# EAGLE design sparrow-though-jack-var (EAGLE 6.1)
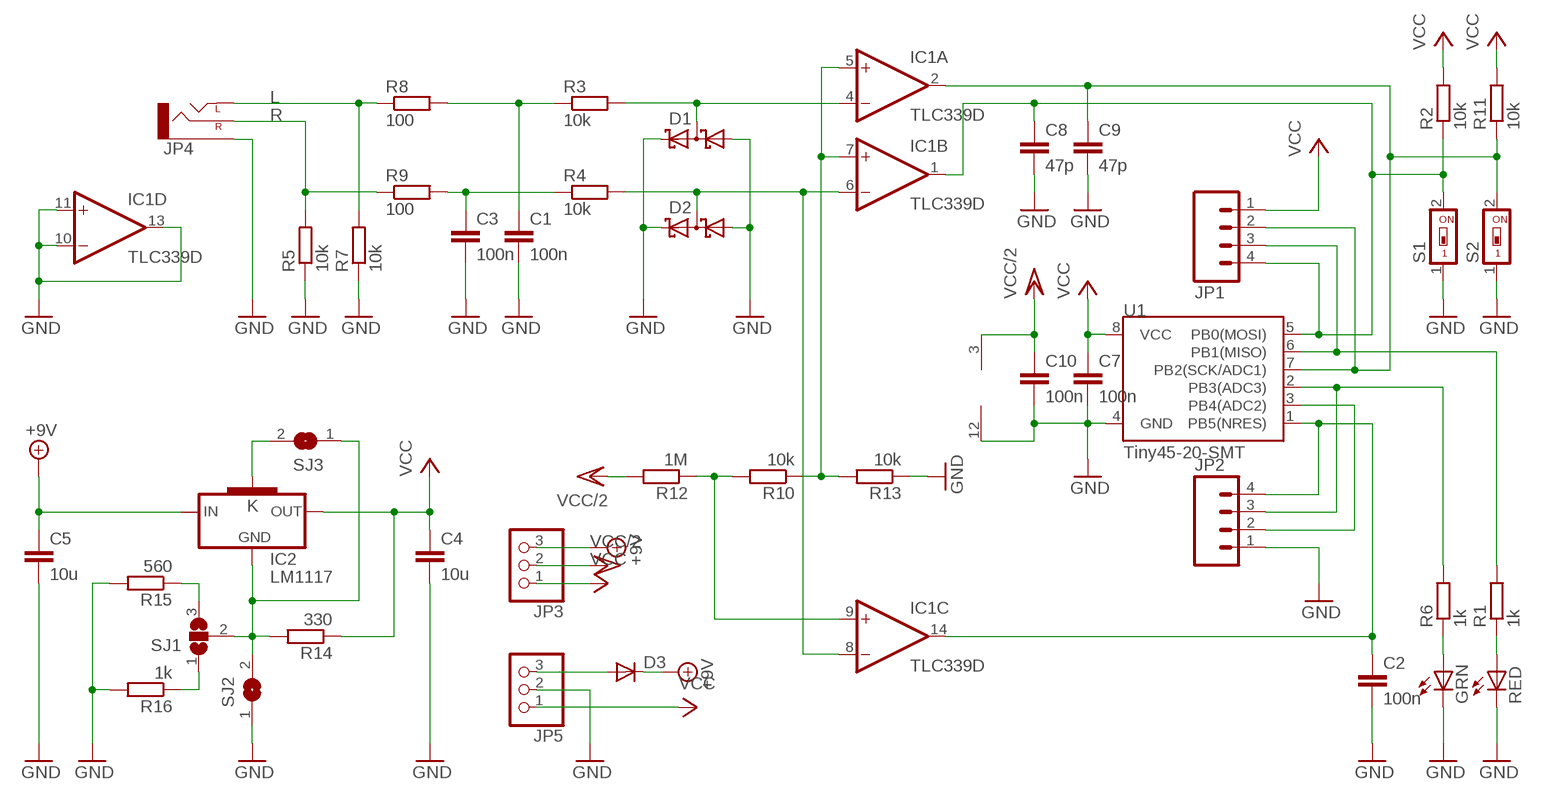
[diagram p0: schematic, sheet 1]

## Parts
C1  100n  C-EUC0805K  [C0805K]
C2  100n  C-EUC0805K  [C0805K]
C3  100n  C-EUC0805K  [C0805K]
C4  10u  C-EUC0805K  [C0805K]
C5  10u  C-EUC0805K  [C0805K]
C7  100n  C-EUC0805K  [C0805K]
C8  47p  C-EUC0805K  [C0805K]
C9  47p  C-EUC0805K  [C0805K]
C10  100n  C-EUC0805K  [C0805K]
D1  BAT54S  [SOT23]
D2  BAT54S  [SOT23]
D3  DIODE-MINIMELF  [MINIMELF]
GRN  LEDCHIP-LED0805  [CHIP-LED0805]
IC1  TLC339D  [SO14]
IC2  LM1117  LD1117S50  [SOT223]
JP1  M04PTH  [1X04]
JP2  M04PTH  [1X04]
JP3  PINHD-1X3  [1X03]
JP4  AUDIO-JACKPIN-HOLES  [AUDIO-JACK-HOLES]
JP5  PINHD-1X3  [1X03]
R1  1k  R-EU_M0805  [M0805]
R2  10k  R-EU_M0805  [M0805]
R3  10k  R-EU_M0805  [M0805]
R4  10k  R-EU_M0805  [M0805]
R5  10k  R-EU_M0805  [M0805]
R6  1k  R-EU_M0805  [M0805]
R7  10k  R-EU_M0805  [M0805]
R8  100  R-EU_M0805  [M0805]
R9  100  R-EU_M0805  [M0805]
R10  10k  R-EU_M0805  [M0805]
R11  10k  R-EU_M0805  [M0805]
R12  1M  R-EU_M0805  [M0805]
R13  10k  R-EU_M0805  [M0805]
R14  330  R-EU_M0805  [M0805]
R15  560  R-EU_M0805  [M0805]
R16  1k  R-EU_M0805  [M0805]
RED  LEDCHIP-LED0805  [CHIP-LED0805]
S1  SWS001  [SMS-001]
S2  SWS001  [SMS-001]
SJ1  SJ2W  [SJ_2]
SJ2  SJ  [SJ]
SJ3  SJ  [SJ]
U1  Tiny45-20-SMT  ATTINY45TINY45-20-SMT  [SO08-EIAJ]

## Nets
+9V: C5.1 D3.C IC2.3(IN) JP3.3
GND: C1.2 C2.2 C3.2 C4.2 C5.2 C7.2 C8.2 C9.2 C10.2 D1.1(A1) D1.2(C2) D2.1(A1) D2.2(C2) GRN.C IC1.10(D:-IN) IC1.11(D:+IN) IC1.12(P:V-) IC1.13(D:OUT) JP2.1 JP4.GND(SLEEVE) JP5.2 R5.1 R7.1 R13.1 R15.2 R16.2 RED.C S1.1 S2.1 SJ2.1 U1.4(GND)
L: JP4.L1-(LEFT) JP4.L2-(LEFT) R7.2 R8.1
N$1: D1.3(C1A2) IC1.4(A:-IN) R3.2
N$2: JP2.3 R6.2 U1.2(PB3(ADC3))
N$3: C2.1 IC1.14(C:OUT) JP2.4 U1.1(PB5(NRES))
N$4: JP2.2 U1.3(PB4(ADC2))
N$5: IC2.4(K) SJ3.2
N$6: D2.3(C1A2) IC1.6(B:-IN) IC1.8(C:-IN) R4.2
N$7: JP1.3 R1.2 U1.6(PB1(MISO))
N$8: C9.1 IC1.2(A:OUT) JP1.2 R11.1 S2.2 U1.7(PB2(SCK/ADC1))
N$9: C1.1 R3.1 R8.2
N$10: GRN.A R6.1
N$11: R1.1 RED.A
N$12: C3.1 R4.1 R9.2
N$13: C8.1 IC1.1(B:OUT) JP1.4 R2.1 S1.2 U1.5(PB0(MOSI))
N$14: IC2.1(GND) R14.2 SJ1.2 SJ2.2 SJ3.1
N$15: R15.1 SJ1.3
N$16: IC1.9(C:+IN) R10.2 R12.1
N$17: IC1.5(A:+IN) IC1.7(B:+IN) R10.1 R13.2
N$18: R16.1 SJ1.1
N$19: D3.A JP5.3
R: JP4.R+(RIGHT) R5.2 R9.1
VCC: C4.1 C7.1 IC2.2(OUT) JP1.1 JP3.1 JP5.1 R2.2 R11.2 R14.1 U1.8(VCC)
VCC/2: C10.1 IC1.3(P:V+) JP3.2 R12.2

## Library data of the parts
C1-C5 C7-C10 = rcl:C-EU: CAPACITOR, European symbol
D1 D2 = diode:BAT54S: Schottky Diodes Pin connection corrected 2011-05-04 Source: Fairchild .. BAT54.pdf
D3 = diode:DIODE-: DIODE
GRN RED = led:LED: LED OSRAM: - CHIPLED LG R971, LG N971, LY N971, LG Q971, LY Q971, LO R971, LY R971 LH N974, LH R974 LS Q976, LO Q976, LY Q976 LO Q996 - Hyper CHIPLED LW Q18S LB Q993, LB Q99A, LB R99A - SideLED LS A670, LO A670, LY A670, LG A670, LP A670 LB A673, LV A673, LT A673, LW A673 LH A674 LY A675 LS A676, LA A676, LO A676, LY A676, LW A676 LS A679, LY A679, LG A679 - Hyper Micro SIDELED® LS Y876, LA Y876, LO Y876, LY Y876 LT Y87S - SmartLED LW L88C, LW L88S LB L89C, LB L89S, LG L890 LS L89K, LO L89K, LY L89K LS L896, LA L896, LO L896, LY L896 - TOPLED LS T670, LO T670, LY T670, LG T670, LP T670 LSG T670, LSP T670, LSY T670, LOP T670, LYG T670 LG T671, LOG T671, LSG T671 LB T673, LV T673, LT T673, LW T673 LH T674 LS T676, LA T676, LO T676, LY T676, LB T676, LH T676, LSB T676, LW T676 LB T67C, LV T67C, LT T67C, LS T67K, LO T67K, LY T67K, LW E67C LS E67B, LA E67B, LO E67B, LY E67B, LB E67C, LV E67C, LT E67C LW T67C LS T679, LY T679, LG T679 LS T770, LO T770, LY T770, LG T770, LP T770 LB T773, LV T773, LT T773, LW T773 LH T774 LS E675, LA E675, LY E675, LS T675 LS T776, LA T776, LO T776, LY T776, LB T776 LHGB T686 LT T68C, LB T68C - Hyper Mini TOPLED® LB M676 - Mini TOPLED Santana® LG M470 LS M47K, LO M47K, LY M47K Source: http://www.osram.convergy.de LUXEON: - LUMILED® LXK2-PW12-R00, LXK2-PW12-S00, LXK2-PW14-U00, LXK2-PW14-V00 LXK2-PM12-R00, LXK2-PM12-S00, LXK2-PM14-U00 LXK2-PE12-Q00, LXK2-PE12-R00, LXK2-PE12-S00, LXK2-PE14-T00, LXK2-PE14-U00 LXK2-PB12-K00, LXK2-PB12-L00, LXK2-PB12-M00, LXK2-PB14-N00, LXK2-PB14-P00, LXK2-PB14-Q00 LXK2-PR12-L00, LXK2-PR12-M00, LXK2-PR14-Q00, LXK2-PR14-R00 LXK2-PD12-Q00, LXK2-PD12-R00, LXK2-PD12-S00 LXK2-PH12-R00, LXK2-PH12-S00 LXK2-PL12-P00, LXK2-PL12-Q00, LXK2-PL12-R00 Source: www.luxeon.com KINGBRIGHT: KA-3528ASYC Source: www.kingbright.com
IC1 = linear:TLC339: COMPARATOR
IC2 = mbed-ics:LD1117S50: VOLTAGE REGULATOR SMD 5V
JP1 JP2 = SparkFun-Connectors:M04: Header 4 Standard 4-pin 0.1" header. Use with straight break away headers (SKU : PRT-00116), right angle break away headers (PRT-00553), swiss pins (PRT-00743), machine pins (PRT-00117), and female headers (PRT-00115). Molex polarized connector foot print use with SKU : PRT-08231 with associated crimp pins and housings. 1MM SMD Version SKU: PRT-10208
JP3 JP5 = pinhead:PINHD-1X3: PIN HEADER
JP4 = _MY_OWN_LIB:AUDIO-JACK: 3.5mm Audio Jack Simple 3.5mm common PCB mount audio jack. SKU: PRT-08032
R1-R16 = rcl:R-EU_: RESISTOR, European symbol
S1 S2 = smd-special:SWS001: SMD Dip Switch 1 pol.
SJ1 = jumper:SJ2W: SMD solder JUMPER
SJ2 SJ3 = jumper:SJ: SMD solder JUMPER
U1 = SparkFun-DigitalIC:ATTINY45: Atmel 8-pin 2/4/8kB flash uC; PROD_ID: IC-08922

## Board
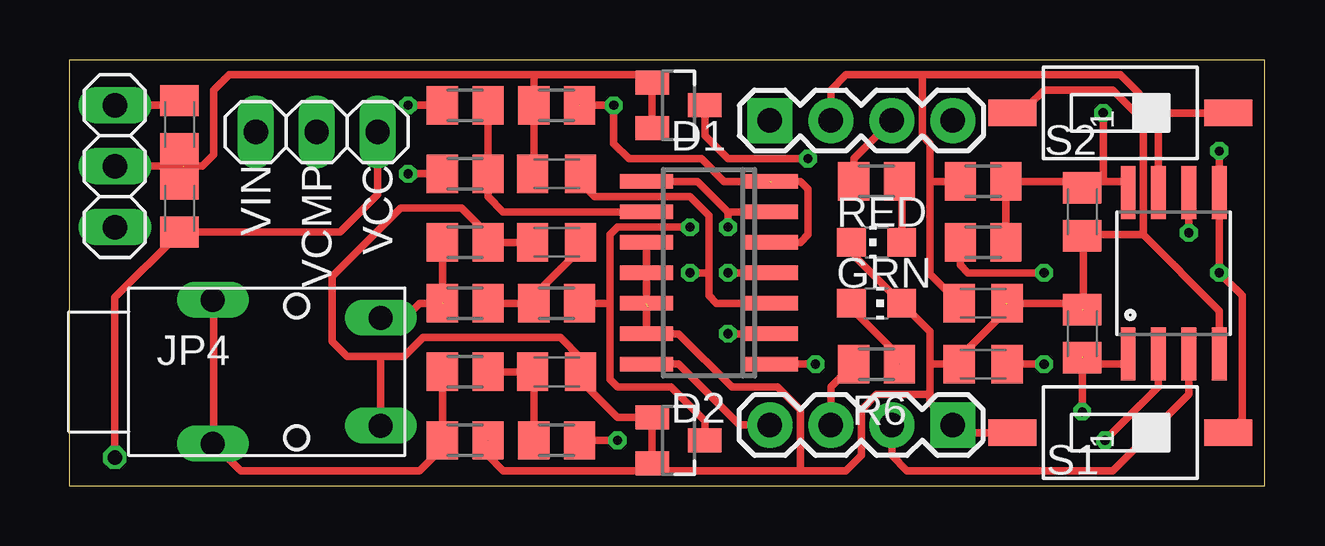
[diagram p1: board, top side]
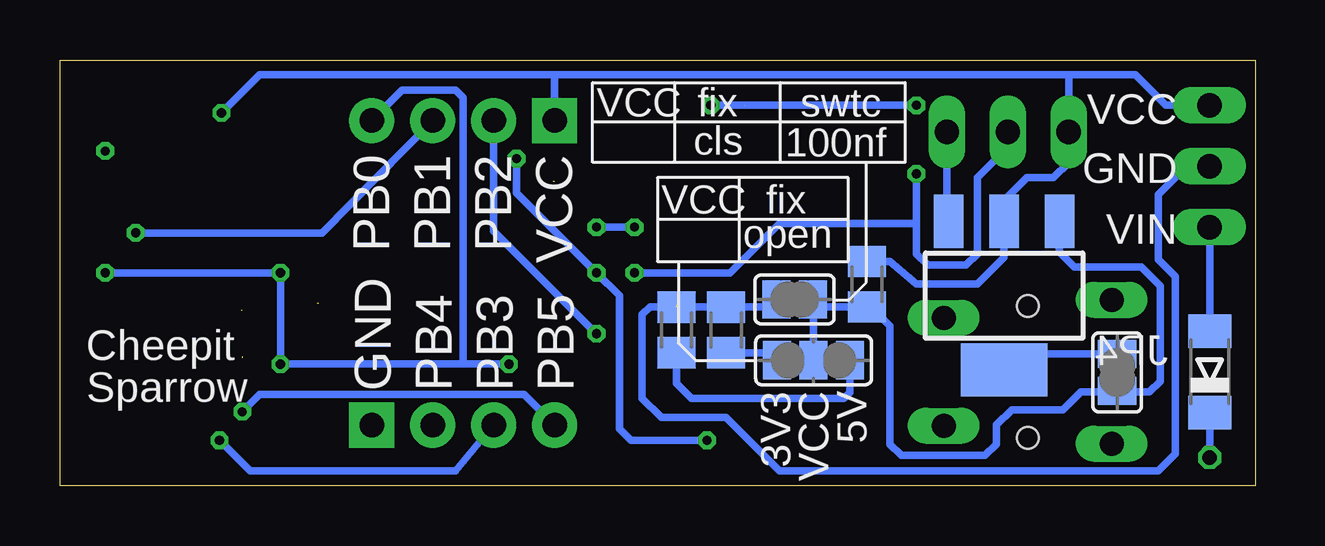
[diagram p2: board, bottom side, seen from below]

Size 49.83 x 17.77 mm. Coordinates in mm from the lower left corner, seen from the top.
Outline: 0,0 49.83,0 49.83,17.77 0,17.77 0,0
Copper layers (1*16): Top 0.0356mm / dielectric 1.5011mm / Bottom 0.0356mm
Design rules: minimum track width 6mil, minimum drill 13mil, track to track 6mil, track to pad 6mil, pad to pad 6mil, via to via 6mil, smd to smd 6mil, copper to edge 15mil, drill to drill 6mil, minimum pad ring 7mil, minimum via ring 7mil, stop-mask expansion 3mil, vias tented up to drill 0mil, thermal gap 10mil

### Footprints (pad centres in the part's own frame; a part is rotated, then mirrored left to right if it is on the bottom)
C0805K = smd 1.3 x 1.6: 1 -1,0; 2 1,0
SOT23 = smd 1 x 1.4: 1 -0.95,-1.1; 2 0.95,-1.1; 3 0,1.1
MINIMELF = smd 1.4 x 1.8: A 1.7,0; C -1.7,0
CHIP-LED0805 = smd 1.2 x 1.2: A 0,-1.05; C 0,1.05
SO14 = smd 0.6 x 2.2: 1 -3.81,-2.6; 2 -2.54,-2.6; 3 -1.27,-2.6; 4 0,-2.6; 5 1.27,-2.6; 6 2.54,-2.6; 7 3.81,-2.6; 8 3.81,2.6; 9 2.54,2.6; 10 1.27,2.6; 11 0,2.6; 12 -1.27,2.6; 13 -2.54,2.6; 14 -3.81,2.6
SOT223 = smd 1.219 x 2.235: 1 -2.311,-3.099; 2 0,-3.099; 3 2.311,-3.099 | smd 3.6 x 2.2: 4 0,3.099
1X04 = drill 1.016 pad 1.88 square: 1 0,0 | drill 1.016 pad 1.88: 2 2.54,0; 3 5.08,0; 4 7.62,0
1X03 = drill 1.016 long: 1 -2.54,0; 2 0,0; 3 2.54,0
AUDIO-JACK-HOLES = drill 1 pad 1.32 long: GND 6,-2.25; L1- -1,-3; L2- -1,3; R+ 6,2.25 | hole 0.9: 2.5,2.75; 2.5,-2.75
M0805 = smd 1.3 x 1.6: 1 -0.95,0; 2 0.95,0
SMS-001 = smd 1.092 x 2.007: 1 0,-4.496; 2 0,4.496
SJ_2 = smd 1.168 x 1.6: 1 -1.524,0; 2 0,0; 3 1.524,0
SJ = smd 1.168 x 1.6: 1 -0.762,0; 2 0.762,0
SO08-EIAJ = smd 0.61 x 2.21: 1 -1.905,-3.378; 2 -0.635,-3.378; 3 0.635,-3.378; 4 1.905,-3.378; 5 1.905,3.353; 6 0.635,3.353; 7 -0.635,3.353; 8 -1.905,3.353

### Placement (x,y rotation side)
C1  20.32,4.76 0 top
C2  42.23,6.35 90 top
C3  20.32,10.16 180 top
C4  4.6,15.07 270 top
C5  4.6,11.58 90 top
C7  42.23,11.43 270 top
C8  38.1,5.08 180 top
C9  38.1,7.62 0 top
C10  20.32,13.02 180 top
D1  25.4,15.88 270 top
D2  25.4,1.91 270 top
D3  1.91,4.76 90 bottom
GRN  33.66,7.62 270 top
IC1  26.67,8.89 90 top
IC2  10.48,7.94 180 bottom
JP1  29.21,15.24 0 top
JP2  36.83,2.54 180 top
JP3  10.32,14.76 0 top
JP4  6.99,4.76 0 top
JP5  1.91,13.34 270 top
R1  33.66,12.7 180 top
R2  38.1,10.16 0 top
R3  20.32,1.91 0 top
R4  20.32,7.62 0 top
R5  16.51,10.16 180 top
R6  33.66,5.08 180 top
R7  16.51,1.91 180 top
R8  16.51,4.76 0 top
R9  16.51,7.62 0 top
R10  16.51,15.88 0 top
R11  38.1,12.7 0 top
R12  16.51,13.02 180 top
R13  20.32,15.88 0 top
R14  16.19,8.41 270 bottom
R15  22.07,6.51 90 bottom
R16  24.13,6.51 90 bottom
RED  33.66,10.16 90 top
S1  43.81,2.22 270 top
S2  43.81,15.56 270 top
SJ1  18.41,5.24 180 bottom
SJ2  19.21,7.78 0 bottom
SJ3  5.76,4.74 90 bottom
U1  46.04,8.89 0 top

### Tracks (layer width: path | path; a pad name or v marks a point on that pad's centre or on a via)
+9V  (via drill 0.6)
  Top 0.305: JP3.3 12.86,12.14 11.3,10.58 C5.1 4.6,10.56 1.91,7.86 v1.91,1.19
  Bottom 0.305: IC2.3 12.86,11.11 JP3.3 | D3.C v1.91,1.19
GND  (5 unrouted)
  Top 0.305: S2.1 40.01,15.88 40.64,16.51 43.5,16.51 44.77,15.24 44.77,10.48 | 44.77,10.48 47.94,7.3 U1.4 | 35.88,3.81 33.66,3.81 33.02,3.17 33.02,1.27 32.38,0.64 30.48,0.64 | 35.88,5.08 35.88,6.45 GRN.C 32.8,9.53 RED.C | 35.88,5.08 35.88,3.81 | C7.2 42.27,10.43 | 35.88,5.08 C8.2 37.42,5.62 37.42,5.67 39.05,7.3 39.05,7.62 | 42.27,7.62 C9.2 | 42.27,10.43 42.27,10.48 44.77,10.48 | 42.27,10.43 42.27,7.62 | 42.27,7.62 42.27,7.35 42.23,7.3 | 21.27,5.03 C1.2 | R7.1 | R5.1 | 24.13,15.24 24.3,15.07 D1.2 D1.1 23.98,17.14 13.97,17.14 | 19.37,13.34 19.37,12.75 C10.2 19.37,13.07 R13.1 19.37,17.14 13.97,17.14 | C3.2 R5.1 | R5.1 17.46,10.48 16.35,11.59 13.81,11.59 10.95,8.73 10.95,6.03 11.59,5.4 13.02,5.4 | 13.97,17.14 6.67,17.14 6.03,16.51 6.03,13.81 5.56,13.34 4.77,13.34 | 35.88,3.81 35.88,3.49 JP2.1 37.15,2.22 S1.1 | C1.2 21.32,5.35 20.48,6.19 14.76,6.19 13.97,5.4 13.02,5.4 | C1.2 21.32,4.4 22.86,2.86 24.13,2.86 24.13,2.85 D2.1 D2.2 24.3,0.81 24.13,0.64 | 30.48,0.64 24.13,0.64 | 24.13,0.64 18.1,0.64 17.46,1.27 R7.1 | 30.48,0.64 30.48,3.17 29.53,4.13 27.62,4.13 25.4,6.35 24.13,6.35 | IC1.10 IC1.11 24.13,8.89 24.07,8.83 IC1.12 24.07,6.41 24.13,6.35 | IC1.13 24.13,6.35 | C4.2 4.76,13.34 | JP5.2 4.77,13.34 | C5.2 4.76,12.85 4.77,13.34 | 13.02,5.4 12.98,5.37 JP4.GND
  Bottom 0.305: 19.84,8.41 19.84,7.78 SJ2.1 20.29,7.46 R15.2 R16.2 25.24,7.46 25.56,7.14 25.56,3.65 24.77,2.86 22.07,2.86 19.84,0.64 4.05,0.64 3.33,1.35 3.33,8.73 4.05,9.45 4.05,12.14 2.86,13.34 JP5.2
L
  Top 0.305: R8.1 R7.2 15.56,1.59 14.61,0.64 7.14,0.64 6.02,1.76 | 6.02,1.76 JP4.L1- | 6.02,1.76 6.02,7.72 5.97,7.76 | JP4.L2- 5.97,7.76 | 5.97,7.76 5.95,7.78
N$1  (via drill 0.38)
  Top 0.305: D1.3 26.5,14.62 27.46,13.65 v30.8,13.65 | v27.46,8.89 IC1.4 | v22.86,1.91 R3.2
  Bottom 0.305: v30.8,13.65 30.8,12.22 v27.46,8.89 26.51,7.94 26.51,2.38 26.04,1.91 v22.86,1.91
N$2  (via drill 0.38)
  Top 0.305: 32.39,5.72 R6.2 31.75,4.12 JP2.3 | v43.18,1.91 45.4,4.13 U1.2
  Bottom 0.305: JP2.3 33.34,0.64 41.91,0.64 v43.18,1.91
N$3  (via drill 0.38)  (1 unrouted)
  Top 0.305: U1.1 44.13,5.08 42.27,5.08 C2.1 | IC1.14 25.4,5.08 27.94,2.54 JP2.4 | v42.23,3.1 42.23,5.4
  Bottom 0.305: JP2.4 30.48,3.81 41.51,3.81 v42.23,3.1
N$4
  Top 0.305: JP2.2 34.29,1.27 34.92,0.64 43.5,0.64 46.67,3.81 U1.3
N$5
  Bottom 0.305: SJ3.2 9.82,5.5 IC2.4
N$6  (via drill 0.38)
  Top 0.305: IC1.6 27.46,11.43 | IC1.8 26.19,12.7 27.46,11.43 | D2.3 26.5,2.71 25.08,4.13 22.86,4.13 22.54,4.45 22.54,7.62 | 22.54,7.62 22.54,10.48 22.86,10.79 v25.88,10.79 | R4.2 22.54,7.62 | 27.46,11.43 v27.46,10.79
  Bottom 0.305: v25.88,10.79 v27.46,10.79
N$7  (via drill 0.38)
  Top 0.305: R1.2 32.7,13.65 JP1.3 | U1.6 v46.67,10.56
  Bottom 0.305: JP1.3 38.89,10.56 v46.67,10.56
N$8  (via drill 0.38)
  Top 0.305: U1.7 45.4,15.56 | JP1.2 31.75,16.51 32.38,17.14 35.56,17.14 | 35.56,17.14 43.81,17.14 45.4,15.56 | 35.56,14.61 35.56,17.14 | 35.56,14.61 | IC1.2 v27.46,6.35 | 35.56,14.61 35.88,14.29 35.88,12.7 | 35.88,12.7 35.88,8.84 C9.1 | R11.1 35.88,12.7 | S2.2 45.4,15.56
  Bottom 0.305: v27.46,6.35 31.75,10.64 JP1.2
N$9
  Top 0.305: R3.1 19.37,4.44 19.32,4.49 C1.1 R8.2
N$10  (1 unrouted)
  Top 0.305: GRN.A 32.6,7.4 34.61,5.4 R6.1
N$11
  Top 0.305: RED.A 34.7,12.28 R1.1
N$12
  Top 0.305: R9.2 R4.1 19.37,7.94 20.95,9.53 20.95,9.79 C3.1
N$13  (via drill 0.38)
  Top 0.305: S1.2 48.9,2.81 48.9,7.94 v47.94,8.89 U1.5 v47.94,13.97 | IC1.1 v31.11,5.08 | 37.15,9.21 R2.1 37.15,9.21 | 37.15,9.21 37.47,8.89 v40.64,8.89 | v40.64,5.08 C8.1 39.05,5.08
  Bottom 0.305: v31.11,5.08 33.02,5.08 | 33.02,5.08 v40.64,5.08 v40.64,8.89 v47.94,8.89 | JP1.4 35.56,16.51 33.34,16.51 33.02,16.19 33.02,5.08
N$14
  Bottom 0.305: SJ1.2 18.41,7.78 SJ2.2 18.44,7.46 R14.2 | R14.2 16.03,7.46 15.24,6.67 15.24,1.75 14.76,1.27 11.27,1.27 10.79,1.75 10.79,2.54 10.16,3.17 8.02,3.17 7.27,3.92 5.27,3.92 | R14.2 16.19,7.78 | 5.27,3.92 4.42,3.92 3.97,4.37 3.97,8.33 4.76,9.13 7.54,9.13 8.17,9.75 IC2.1 | SJ3.1 5.33,3.97 5.27,3.92
N$15
  Bottom 0.305: R15.1 20.26,5.56 SJ1.3
N$16
  Top 0.305: IC1.9 18.1,11.43 17.46,12.07 R12.1 R10.2
N$17  (via drill 0.38)  (2 unrouted)
  Top 0.305: IC1.5 30.48,10.16 30.8,10.48 30.8,12.38 30.48,12.7 IC1.7 | 29.21,12.7 27.3,12.7 26.35,13.65 23.34,13.65 22.7,14.29 v22.7,15.88 R13.2 | v14.13,15.88 R10.1
  Bottom 0.305: v22.7,15.88 v14.13,15.88
N$18
  Bottom 0.305: SJ1.1 16.89,3.9 17.14,3.65 23.5,3.65 24.13,4.29 R16.1
N$19
  Bottom 0.305: JP5.3 D3.A
R  (1 unrouted)
  Top 0.305: R5.2 R9.1 14.61,7.62 14,7.01 13.04,7.01 13.02,6.99 JP4.R+
VCC  (via drill 0.38)
  Top 0.305: R2.2 R11.2 42.86,12.7 | 42.86,12.7 43.1,12.7 | 43.1,12.7 44.13,12.7 U1.8 | C7.1 42.81,12.43 42.86,12.7 | C4.1 4.52,15.95 4.45,15.88 JP5.1 | v43.1,15.56 43.1,12.7
  Bottom 0.305: v43.1,15.56 41.51,17.14 29.21,17.14 | JP1.1 29.21,17.14 | 7.78,17.14 29.21,17.14 | 7.78,14.13 JP3.1 7.78,17.14 | 7.78,14.13 | 7.78,14.13 7.78,14.05 | 7.78,14.05 7.78,13.49 8.41,12.86 9.53,12.86 10.48,11.91 IC2.2 10.48,9.53 11.59,8.41 14.13,8.41 15.24,9.37 R14.1 | 7.75,14.1 7.78,14.13 | 7.75,14.1 7.78,14.13 | 7.73,14.1 7.78,14.05 | JP5.1 3.73,15.88 5,17.14 7.78,17.14
VCC/2  (via drill 0.38)
  Top 0.305: C10.1 21.32,12.65 21.91,12.06 25.88,12.06 26.67,11.27 26.67,8.89 | 26.67,8.89 26.67,7.94 26.99,7.62 IC1.3 | v25.88,8.89 26.67,8.89 | R12.2 v14.13,13.02
  Bottom 0.305: JP3.2 10.32,14.13 11.59,12.86 11.59,9.68 12.06,9.21 13.65,9.21 14.13,9.68 14.13,10.95 | 14.13,10.95 v14.13,13.02 | v25.88,8.89 21.91,8.89 19.84,10.95 14.13,10.95

### Text on the board
tPlace: VIN | VCMP | VCC
bPlace: VCC | swtc | fix | VCC | GND | 100nf | cls | VCC | PB2 | PB1 | PB0 | VIN | fix | VCC | open | Cheepit | 5V | VCC | 3V3 | PB5 | PB3 | PB4 | GND | Sparrow